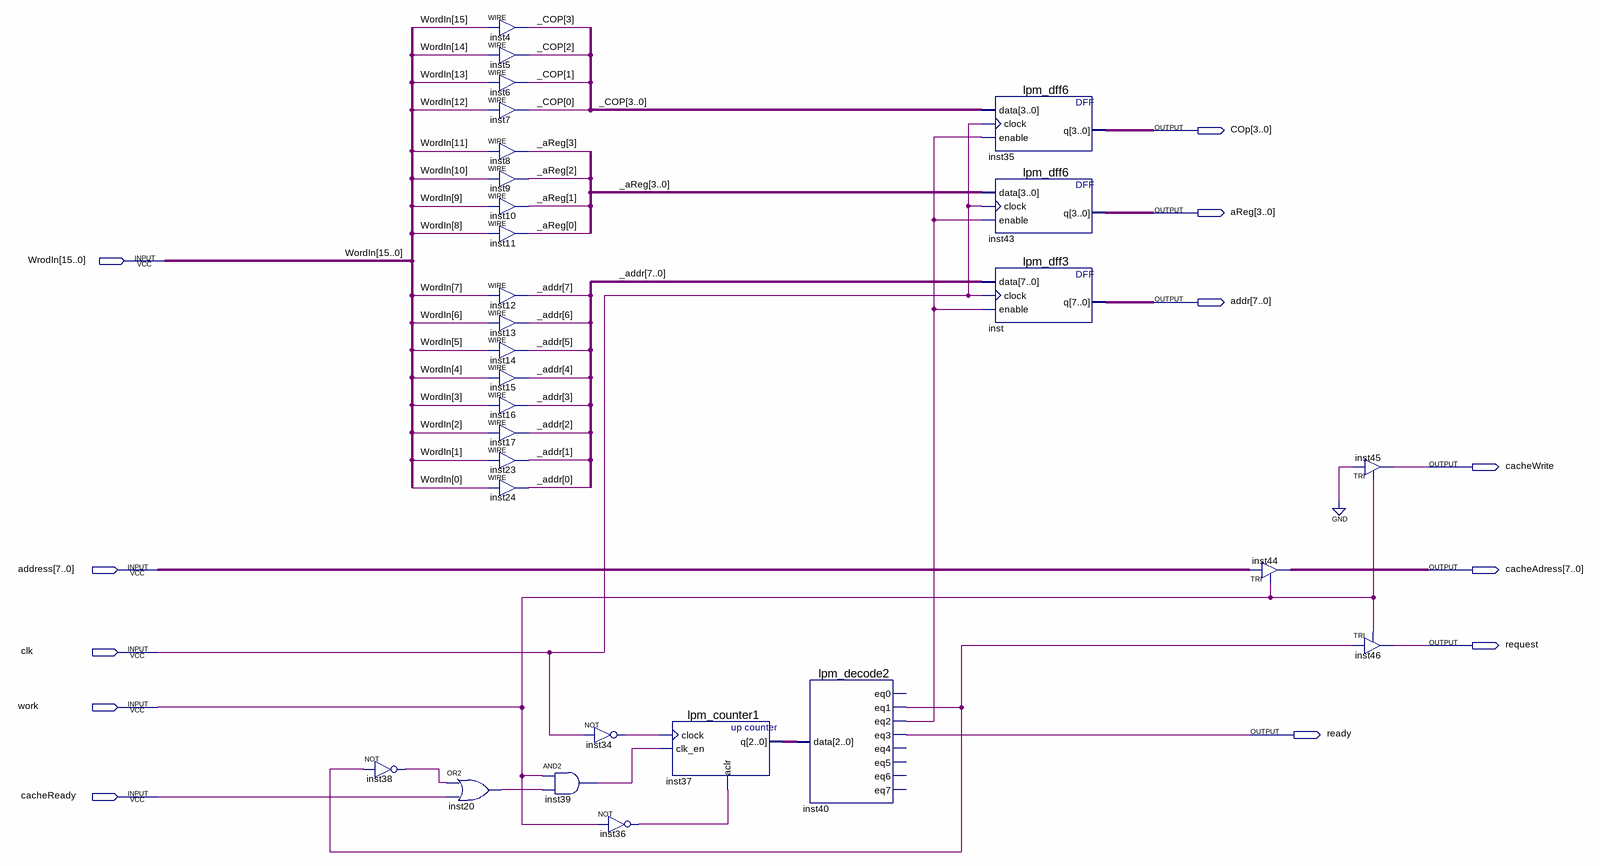
[diagram p0: schematic sheet]
// Quartus schematic GetAndDecodeCommand.bdf as structural Verilog: 29 symbols, 12 pins
module GetAndDecodeCommand (
  input  [15:0] WrodIn,
  input  [7:0] address,
  input  clk,
  input  work,
  input  cacheReady,
  output [3:0] COp,
  output [3:0] aReg,
  output [7:0] addr,
  output cacheWrite,
  output [7:0] cacheAdress,
  output request,
  output ready
);

  wire inst20_out, inst34_out, inst36_out, inst38_out, inst39_out, inst40_eq1, inst40_eq2;
  wire [2:0] inst37_q;
  wire [3:0] _aReg, _COP;
  wire [7:0] _addr;

  not inst38 (inst38_out, inst40_eq1);
  or inst20 (inst20_out, inst38_out, cacheReady);
  assign _COP[3] = WrodIn[15];  // WIRE inst4
  assign _COP[2] = WrodIn[14];  // WIRE inst5
  assign _COP[1] = WrodIn[13];  // WIRE inst6
  assign _COP[0] = WrodIn[12];  // WIRE inst7
  assign _aReg[3] = WrodIn[11];  // WIRE inst8
  assign _aReg[2] = WrodIn[10];  // WIRE inst9
  assign _aReg[1] = WrodIn[9];  // WIRE inst10
  assign _aReg[0] = WrodIn[8];  // WIRE inst11
  assign _addr[7] = WrodIn[7];  // WIRE inst12
  assign _addr[6] = WrodIn[6];  // WIRE inst13
  assign _addr[5] = WrodIn[5];  // WIRE inst14
  assign _addr[4] = WrodIn[4];  // WIRE inst15
  assign _addr[3] = WrodIn[3];  // WIRE inst16
  assign _addr[2] = WrodIn[2];  // WIRE inst17
  assign _addr[1] = WrodIn[1];  // WIRE inst23
  assign _addr[0] = WrodIn[0];  // WIRE inst24
  and inst39 (inst39_out, work, inst20_out);
  not inst34 (inst34_out, clk);
  not inst36 (inst36_out, work);
  lpm_counter1 inst37 (.clock(inst34_out), .clk_en(inst39_out), .aclr(inst36_out), .q(inst37_q));
  lpm_decode2 inst40 (
    .data(inst37_q), .eq1(inst40_eq1), .eq2(inst40_eq2), .eq3(ready));  // open: eq0, eq4, eq5, eq6, eq7
  lpm_dff6 inst35 (.data(_COP), .clock(clk), .enable(inst40_eq2), .q(COp));
  lpm_dff6 inst43 (.data(_aReg), .clock(clk), .enable(inst40_eq2), .q(aReg));
  lpm_dff3 inst (.data(_addr), .clock(clk), .enable(inst40_eq2), .q(addr));
  TRI inst44[7:0] (.IN(address), .OE(work), .OUT(cacheAdress));
  TRI inst45 (.IN(1'b0), .OE(work), .OUT(cacheWrite));
  TRI inst46 (.IN(inst40_eq1), .OE(work), .OUT(request));

  // Other names for the same wires on the sheet: WordIn[15:0] = WrodIn
endmodule
